# EAGLE design AD595_thermocouple_breakout_board-rev2 (EAGLE 6.2)
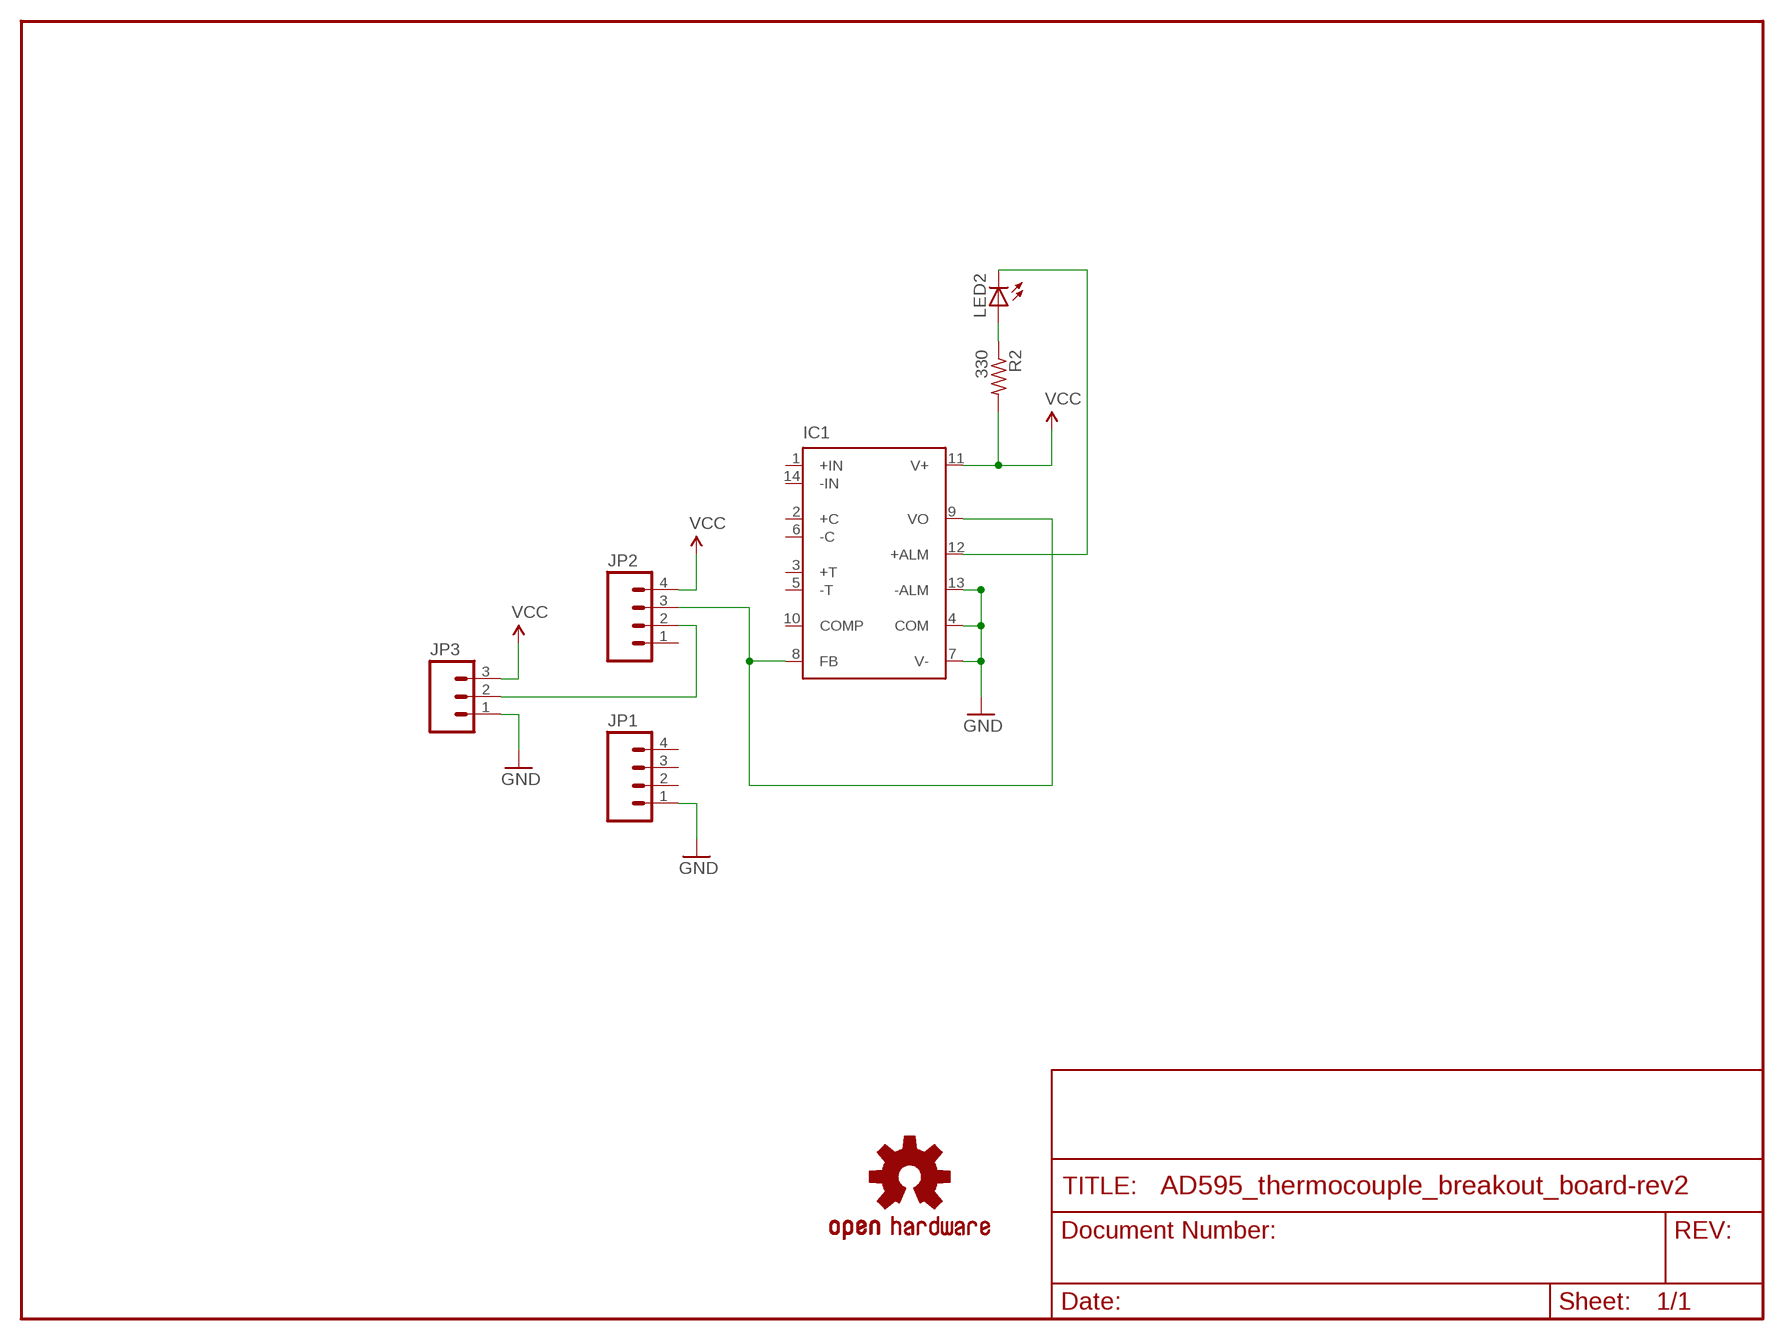
[diagram p0: schematic, sheet 1]

## Parts
IC1  AD595  [DIL14]
JP1  M04LOCK  [1X04_LOCK]
JP2  M04LOCK  [1X04_LOCK]
JP3  M03SCREW_LOCK  [SCREWTERMINAL-3.5MM-3_LOCK.007S]
LED2  LED5MM  [LED5MM]
R2  330  R-US_0207/7  [0207/7]
U$1  OSHW-LOGOS  [OSHW-LOGO-S]

## Nets
GND: IC1.4(COM) IC1.7(V-) IC1.13(-ALM) JP1.1 JP3.1
N$1: JP2.2 JP3.2
N$2: IC1.8(FB) IC1.9(VO) JP2.3
N$7: LED2.A R2.1
N$8: IC1.12(+ALM) LED2.K(C)
VCC: IC1.11(V+) JP2.4 JP3.3 R2.2
Unconnected: IC1.1(+IN) IC1.2(+C) IC1.3(+T) IC1.5(-T) IC1.6(-C) IC1.10(COMP) IC1.14(-IN) JP1.2 JP1.3 JP1.4 JP2.1

## Library data of the parts
IC1 = analog-devices:AD595: ANALOG DEVICES
JP1 JP2 = SparkFun:M04: Header 4 Standard 4-pin 0.1" header. Use with straight break away headers (SKU : PRT-00116), right angle break away headers (PRT-00553), swiss pins (PRT-00743), machine pins (PRT-00117), and female headers (PRT-00115). Molex polarized connector foot print use with SKU : PRT-08231 with associated crimp pins and housings. 1MM SMD Version SKU: PRT-10208
JP3 = SparkFun-Connectors:M03: Header 3 Standard 3-pin 0.1" header. Use with straight break away headers (SKU : PRT-00116), right angle break away headers (PRT-00553), swiss pins (PRT-00743), machine pins (PRT-00117), and female headers (PRT-00115). Molex polarized connector foot print use with SKU : PRT-08232 with associated crimp pins and housings.
LED2 = led:LED: LED OSRAM: - CHIPLED LG R971, LG N971, LY N971, LG Q971, LY Q971, LO R971, LY R971 LH N974, LH R974 LS Q976, LO Q976, LY Q976 LO Q996 - Hyper CHIPLED LW Q18S LB Q993, LB Q99A, LB R99A - SideLED LS A670, LO A670, LY A670, LG A670, LP A670 LB A673, LV A673, LT A673, LW A673 LH A674 LY A675 LS A676, LA A676, LO A676, LY A676, LW A676 LS A679, LY A679, LG A679 - Hyper Micro SIDELED® LS Y876, LA Y876, LO Y876, LY Y876 LT Y87S - SmartLED LW L88C, LW L88S LB L89C, LB L89S, LG L890 LS L89K, LO L89K, LY L89K LS L896, LA L896, LO L896, LY L896 - TOPLED LS T670, LO T670, LY T670, LG T670, LP T670 LSG T670, LSP T670, LSY T670, LOP T670, LYG T670 LG T671, LOG T671, LSG T671 LB T673, LV T673, LT T673, LW T673 LH T674 LS T676, LA T676, LO T676, LY T676, LB T676, LH T676, LSB T676, LW T676 LB T67C, LV T67C, LT T67C, LS T67K, LO T67K, LY T67K, LW E67C LS E67B, LA E67B, LO E67B, LY E67B, LB E67C, LV E67C, LT E67C LW T67C LS T679, LY T679, LG T679 LS T770, LO T770, LY T770, LG T770, LP T770 LB T773, LV T773, LT T773, LW T773 LH T774 LS E675, LA E675, LY E675, LS T675 LS T776, LA T776, LO T776, LY T776, LB T776 LHGB T686 LT T68C, LB T68C - Hyper Mini TOPLED® LB M676 - Mini TOPLED Santana® LG M470 LS M47K, LO M47K, LY M47K Source: http://www.osram.convergy.de - LUMILED® LXK2-PW12-R00, LXK2-PW12-S00, LXK2-PW14-U00, LXK2-PW14-V00 LXK2-PM12-R00, LXK2-PM12-S00, LXK2-PM14-U00 LXK2-PE12-Q00, LXK2-PE12-R00, LXK2-PE12-S00, LXK2-PE14-T00, LXK2-PE14-U00 LXK2-PB12-K00, LXK2-PB12-L00, LXK2-PB12-M00, LXK2-PB14-N00, LXK2-PB14-P00, LXK2-PB14-Q00 LXK2-PR12-L00, LXK2-PR12-M00, LXK2-PR14-Q00, LXK2-PR14-R00 LXK2-PD12-Q00, LXK2-PD12-R00, LXK2-PD12-S00 LXK2-PH12-R00, LXK2-PH12-S00 LXK2-PL12-P00, LXK2-PL12-Q00, LXK2-PL12-R00 Source: www.luxeon.com
R2 = rcl:R-US_: RESISTOR, American symbol
U$1 = SparkFun:OSHW-LOGO: Open Source Hardware Logo This logo indicates the piece of hardware it is found on incorporates a OSHW license and/or adheres to the definition of open source hardware found here: http://freedomdefined.org/OSHW

## Board
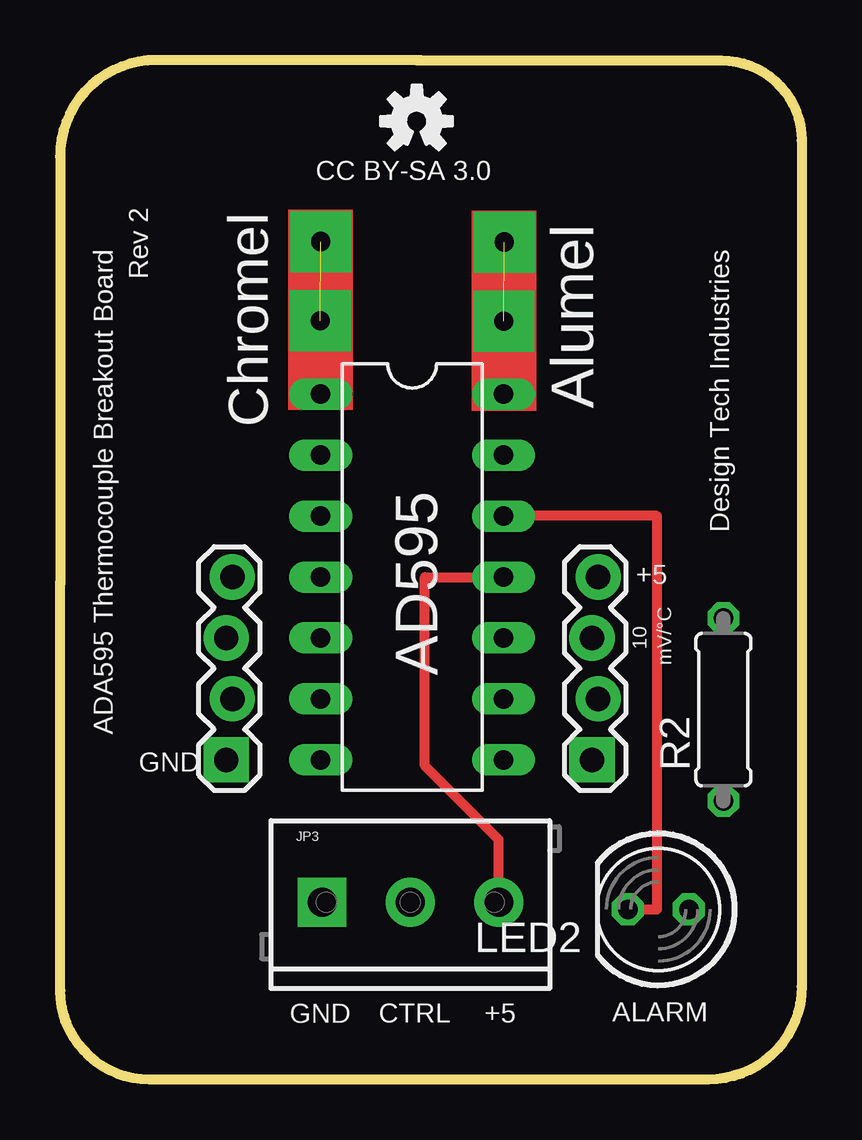
[diagram p1: board, top side]
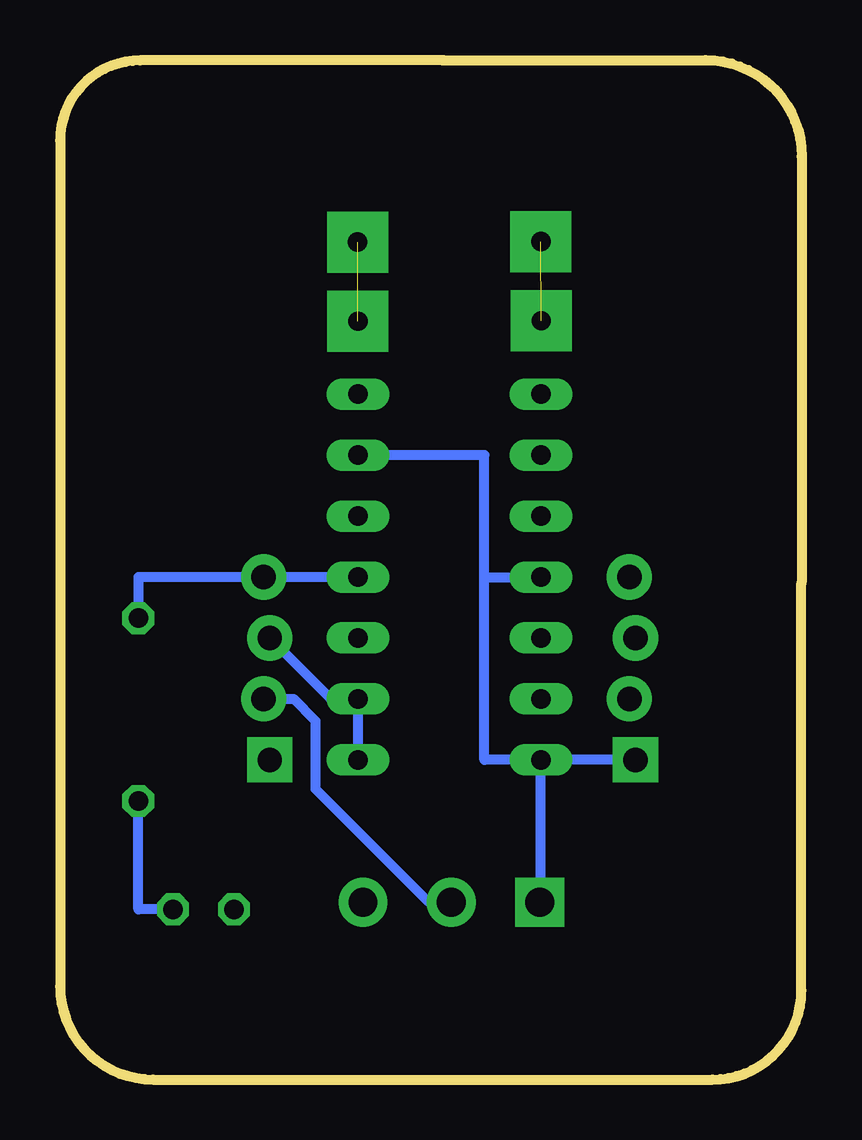
[diagram p2: board, bottom side, seen from below]

Size 30.91 x 42.48 mm. Coordinates in mm from the lower left corner, seen from the top.
Outline: 14.87,42.46 27.57,42.46 arc-90 30.9,39.13 30.9,3.88 arc-90 27.02,0 3.72,0 arc-90 0.01,3.71 0.01,20.68
Outline: 15.01,42.48 4.01,42.48 arc90 0,38.47 0,20.72
Copper layers (1*16): Top 0.035mm / dielectric 1.5mm / Bottom 0.035mm
Design rules: minimum track width 10mil, minimum drill 24mil, track to track 8mil, track to pad 8mil, pad to pad 8mil, via to via 8mil, smd to smd 8mil, copper to edge 40mil, drill to drill 8mil, minimum pad ring 10mil, minimum via ring 8mil, stop-mask expansion 4mil, vias tented up to drill 0mil, thermal gap 10mil

### Footprints (pad centres in the part's own frame; a part is rotated, then mirrored left to right if it is on the bottom)
DIL14 = drill 0.813 long: 1 -7.62,-3.81; 2 -5.08,-3.81; 3 -2.54,-3.81; 4 0,-3.81; 5 2.54,-3.81; 6 5.08,-3.81; 7 7.62,-3.81; 8 7.62,3.81; 9 5.08,3.81; 10 2.54,3.81; 11 0,3.81; 12 -2.54,3.81; 13 -5.08,3.81; 14 -7.62,3.81
1X04_LOCK = drill 1.016 pad 1.88 square: 1 0,0.127 | drill 1.016 pad 1.88: 2 2.54,-0.127; 3 5.08,0.127; 4 7.62,-0.127
SCREWTERMINAL-3.5MM-3_LOCK.007S = drill 1.2 pad 2.032 square: 1 -0.178,0 | drill 1.2 pad 2.032: 2 3.5,0; 3 7.178,0
LED5MM = drill 0.813 octagon: A -1.27,0; K 1.27,0
0207/7 = drill 0.813 octagon: 1 -3.81,0; 2 3.81,0

### Placement (x,y rotation side)
IC1  14.67,20.94 270 top
JP1  7.05,13.32 90 top
JP2  22.29,13.32 90 top
JP3  11.1,7.39 0 top
LED2  24.93,7.09 180 top
R2  27.64,15.41 90 top
U$1  14.86,39.93 0 top

### Tracks (layer width: path | path; a pad name or v marks a point on that pad's centre or on a via)
GND
  Bottom 0.406: IC1.13 13.22,26.02 13.22,20.94 | JP1.1 IC1.7 | IC1.7 13.22,13.32 13.22,20.94 | 13.22,20.94 IC1.4 | JP3.1 10.86,7.39 IC1.7
N$1
  Bottom 0.406: JP3.2 15.54,7.39 20.25,12.1 20.25,14.94 21.17,15.86 JP2.2
N$2
  Bottom 0.406: IC1.8 IC1.9 19.63,15.86 JP2.3
N$3  (via drill 0.8 pad 2.54)  (1 unrouted)
  other vias: 18.49,31.6 18.51,34.9
N$7
  Bottom 0.406: LED2.A 27.64,7.09 R2.1
N$8
  Top 0.406: LED2.K 24.88,7.09 24.88,23.48 IC1.12
N$9  (via drill 0.8 pad 2.54)  (1 unrouted)
  other vias: 10.85,31.61 10.87,34.91
VCC
  Top 0.406: JP3.3 18.28,10 15.2,13.08 15.2,20.94 IC1.11
  Bottom 0.406: IC1.11 JP2.4 27.64,20.94 R2.2
(copper drawn outside any net)
  shapes: Top area x2

### Text on the board
tPlace: CC BY-SA 3.0 | Rev 2 | Alumel | Chromel | Design Tech Industries | +5 | 10 | mV/°C | AD595 | ADA595 Thermocouple Breakout Board | GND | GND | CTRL | +5 | ALARM